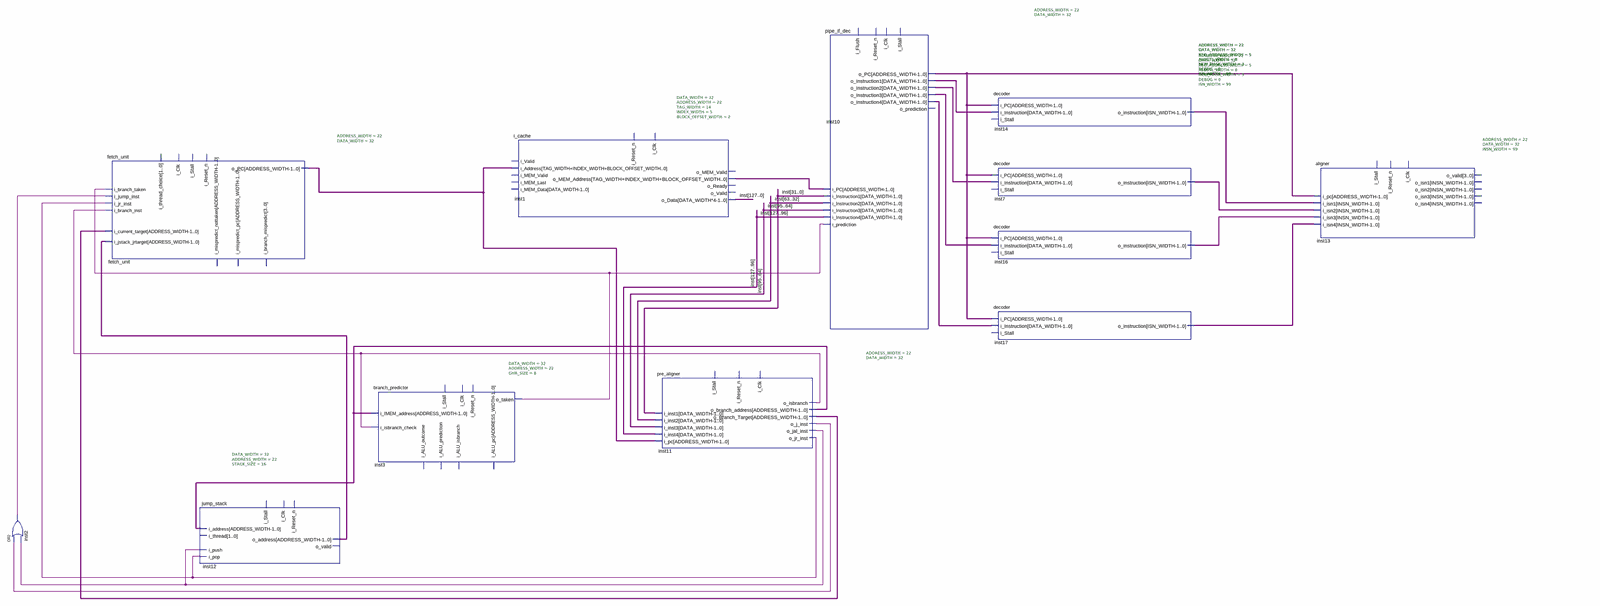
[diagram p0: schematic sheet, whole]
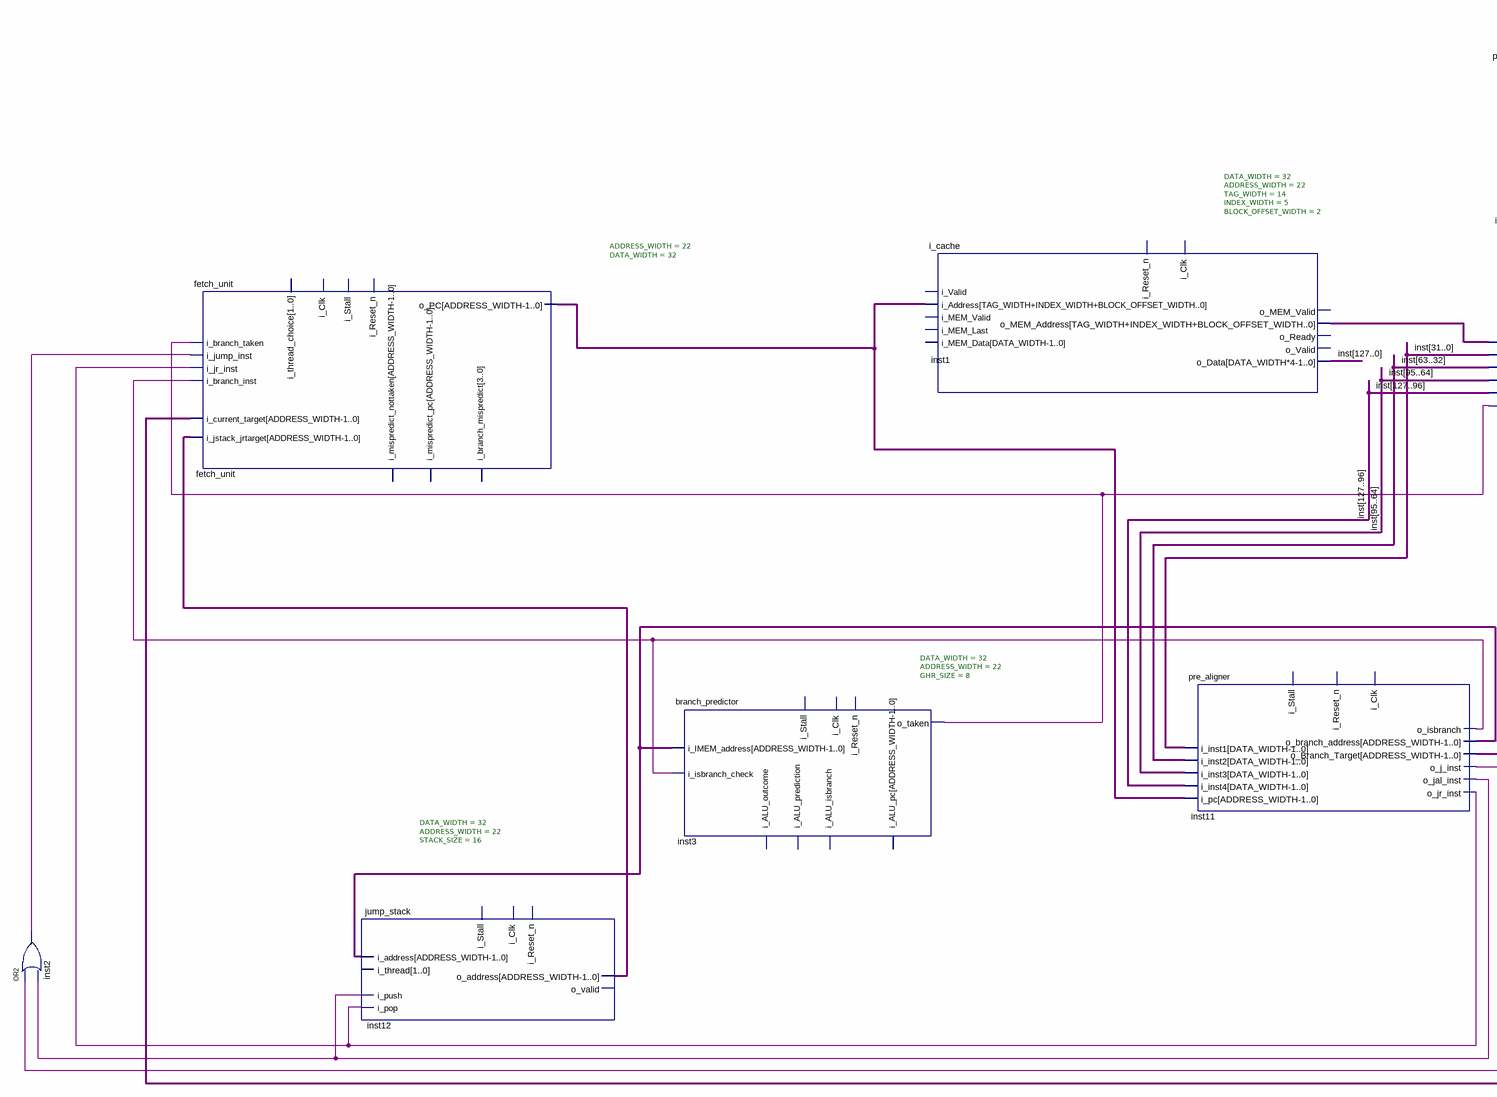
[diagram p1: schematic sheet, left part]
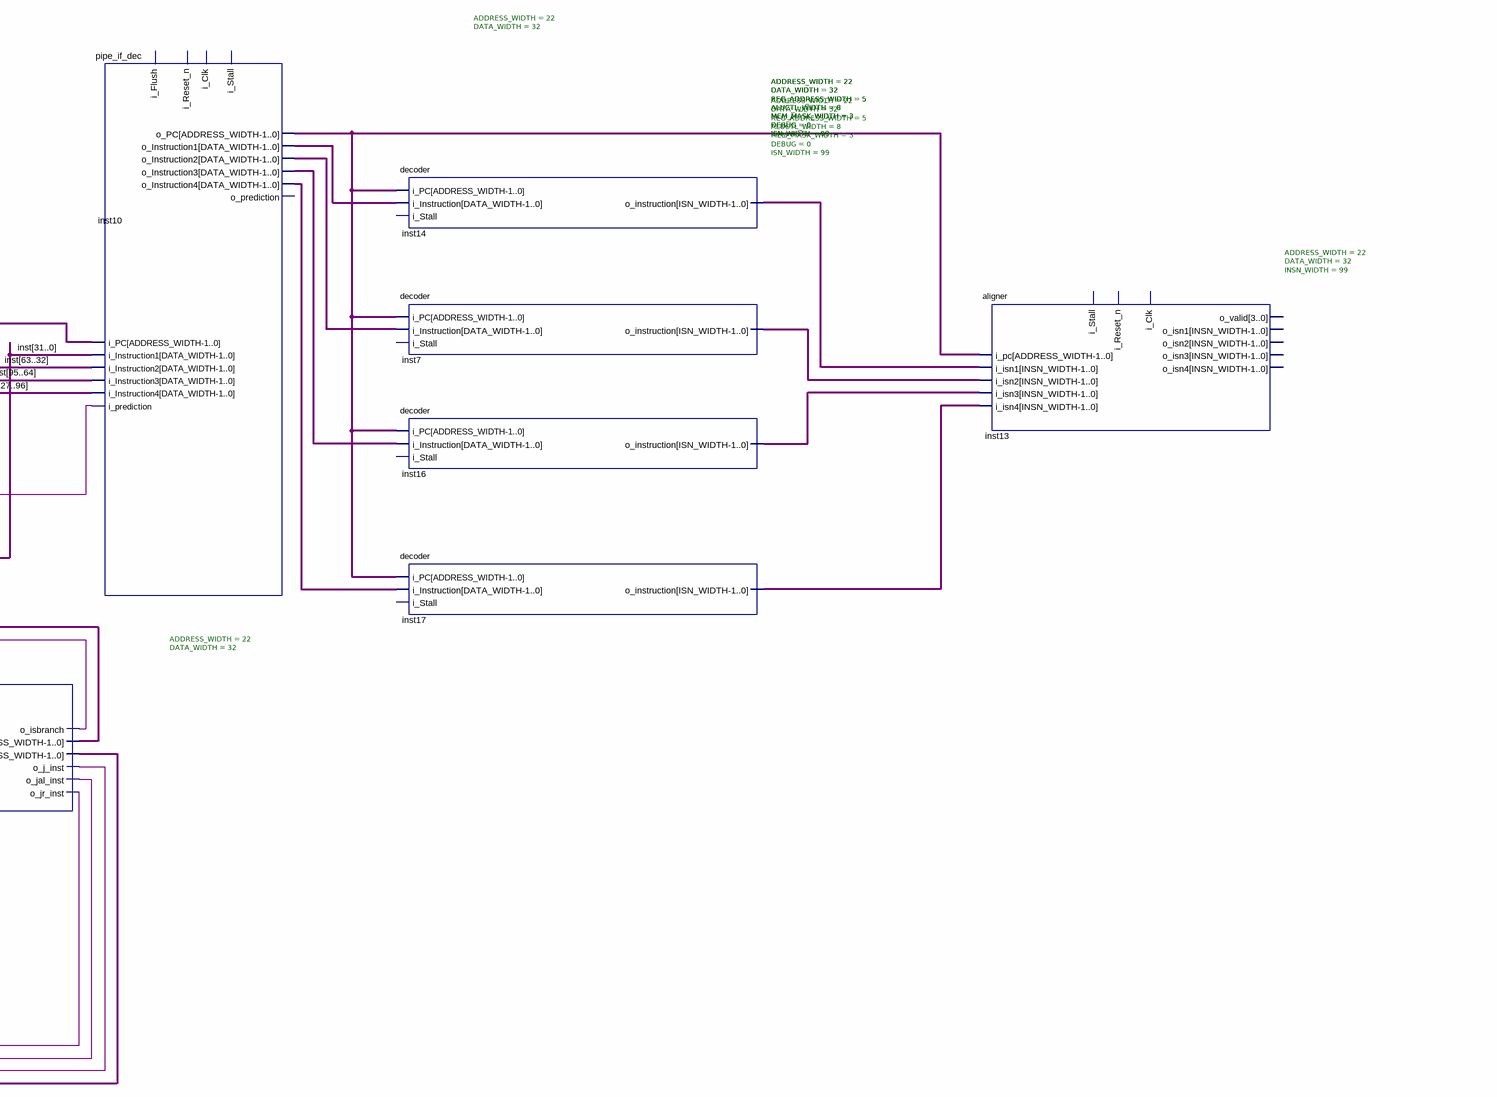
[diagram p2: schematic sheet, right part]
// Quartus schematic Frontend.bdf as structural Verilog: 12 symbols, 0 pins
module Frontend (
);

  wire inst2_out, inst3_o_taken, inst11_o_isbranch, inst11_o_j_inst, inst11_o_jal_inst, inst11_o_jr_inst;
  wire [21:0] fetch_unit_o_pc, inst1_o_mem_address, inst10_o_pc, inst11_o_branch_address,
       inst11_o_branch_target, inst12_o_address;
  wire [31:0] inst10_o_instruction1, inst10_o_instruction2, inst10_o_instruction3, inst10_o_instruction4;
  wire [98:0] inst7_o_instruction, inst14_o_instruction, inst16_o_instruction, inst17_o_instruction;
  wire [127:0] inst;

  or inst2 (inst2_out, inst11_o_j_inst, inst11_o_jal_inst);
  fetch_unit #(.ADDRESS_WIDTH(22), .DATA_WIDTH(32)) fetch_unit (
    .i_branch_taken(inst3_o_taken), .i_jump_inst(inst2_out), .i_jr_inst(inst11_o_jr_inst),
    .i_branch_inst(inst11_o_isbranch), .i_current_target(inst11_o_branch_target),
    .i_jstack_jrtarget(inst12_o_address), .o_PC(fetch_unit_o_pc));  // open: i_Clk, i_Reset_n, i_Stall, i_branch_mispredict, i_thread_choice, i_mispredict_nottaken, i_mispredict_pc
  jump_stack #(.DATA_WIDTH(32), .ADDRESS_WIDTH(22), .STACK_SIZE(16)) inst12 (
    .i_address(inst11_o_branch_address), .i_pop(inst11_o_jr_inst), .i_push(inst11_o_jal_inst),
    .o_address(inst12_o_address));  // open: i_Clk, i_Stall, i_thread, i_Reset_n, o_valid
  branch_predictor #(.DATA_WIDTH(32), .ADDRESS_WIDTH(22), .GHR_SIZE(8)) inst3 (
    .i_IMEM_address(inst11_o_branch_address), .i_isbranch_check(inst11_o_isbranch), .o_taken(inst3_o_taken));  // open: i_Clk, i_ALU_outcome, i_ALU_pc, i_ALU_isbranch, i_ALU_prediction, i_Reset_n, i_Stall
  i_cache #(.DATA_WIDTH(32), .ADDRESS_WIDTH(22), .TAG_WIDTH(14), .INDEX_WIDTH(5), .BLOCK_OFFSET_WIDTH(2)) inst1 (
    .i_Address(fetch_unit_o_pc), .o_MEM_Address(inst1_o_mem_address), .o_Data(inst));  // open: i_Clk, i_Reset_n, i_Valid, i_MEM_Valid, i_MEM_Last, i_MEM_Data, o_MEM_Valid, o_Ready, o_Valid
  pre_aligner #(.ADDRESS_WIDTH(22), .DATA_WIDTH(32)) inst11 (
    .i_pc(fetch_unit_o_pc), .i_inst1(inst[31:0]), .i_inst2(inst[63:32]), .i_inst3(inst[95:64]),
    .i_inst4(inst[127:96]), .o_isbranch(inst11_o_isbranch), .o_branch_address(inst11_o_branch_address),
    .o_Branch_Target(inst11_o_branch_target), .o_j_inst(inst11_o_j_inst), .o_jal_inst(inst11_o_jal_inst),
    .o_jr_inst(inst11_o_jr_inst));  // open: i_Clk, i_Reset_n, i_Stall
  pipe_if_dec #(.ADDRESS_WIDTH(22), .DATA_WIDTH(32)) inst10 (
    .i_PC(inst1_o_mem_address), .i_Instruction1(inst[31:0]), .i_Instruction2(inst[63:32]),
    .i_Instruction3(inst[95:64]), .i_Instruction4(inst[127:96]), .i_prediction(inst3_o_taken),
    .o_PC(inst10_o_pc), .o_Instruction1(inst10_o_instruction1), .o_Instruction2(inst10_o_instruction2),
    .o_Instruction3(inst10_o_instruction3), .o_Instruction4(inst10_o_instruction4));  // open: i_Clk, i_Reset_n, i_Flush, i_Stall, o_prediction
  decoder #(.ADDRESS_WIDTH(22), .DATA_WIDTH(32), .REG_ADDRESS_WIDTH(5), .ALUCTL_WIDTH(8), .MEM_MASK_WIDTH(3), .DEBUG(0), .ISN_WIDTH(99)) inst14 (
    .i_PC(inst10_o_pc), .i_Instruction(inst10_o_instruction1), .o_instruction(inst14_o_instruction));  // open: i_Stall
  decoder #(.ADDRESS_WIDTH(22), .DATA_WIDTH(32), .REG_ADDRESS_WIDTH(5), .ALUCTL_WIDTH(8), .MEM_MASK_WIDTH(3), .DEBUG(0), .ISN_WIDTH(99)) inst7 (
    .i_PC(inst10_o_pc), .i_Instruction(inst10_o_instruction2), .o_instruction(inst7_o_instruction));  // open: i_Stall
  decoder #(.ADDRESS_WIDTH(22), .DATA_WIDTH(32), .REG_ADDRESS_WIDTH(5), .ALUCTL_WIDTH(8), .MEM_MASK_WIDTH(3), .DEBUG(0), .ISN_WIDTH(99)) inst16 (
    .i_PC(inst10_o_pc), .i_Instruction(inst10_o_instruction3), .o_instruction(inst16_o_instruction));  // open: i_Stall
  decoder #(.ADDRESS_WIDTH(22), .DATA_WIDTH(32), .REG_ADDRESS_WIDTH(5), .ALUCTL_WIDTH(8), .MEM_MASK_WIDTH(3), .DEBUG(0), .ISN_WIDTH(99)) inst17 (
    .i_PC(inst10_o_pc), .i_Instruction(inst10_o_instruction4), .o_instruction(inst17_o_instruction));  // open: i_Stall
  aligner #(.ADDRESS_WIDTH(22), .DATA_WIDTH(32), .INSN_WIDTH(99)) inst13 (
    .i_pc(inst10_o_pc), .i_isn1(inst14_o_instruction), .i_isn2(inst7_o_instruction),
    .i_isn3(inst16_o_instruction), .i_isn4(inst17_o_instruction));  // open: i_Clk, i_Reset_n, i_Stall, o_valid, o_isn1, o_isn2, o_isn3, o_isn4
endmodule
